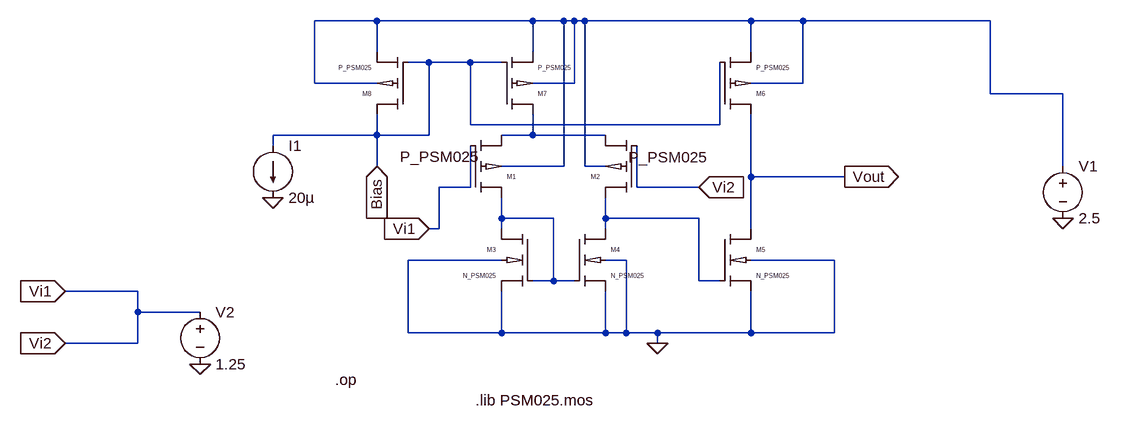
[diagram p0: schematic operating_point_opamp.asc]
operating_point_opamp.asc, the LTspice schematic file:
Version 4
SHEET 1 1260 680
WIRE 144 0 48 0
WIRE 384 0 144 0
WIRE 432 0 384 0
WIRE 448 0 432 0
WIRE 464 0 448 0
WIRE 720 0 464 0
WIRE 800 0 720 0
WIRE 1088 0 800 0
WIRE 144 48 144 0
WIRE 384 48 384 0
WIRE 720 48 720 0
WIRE 224 64 192 64
WIRE 288 64 224 64
WIRE 336 64 288 64
WIRE 48 96 48 0
WIRE 144 96 48 96
WIRE 448 96 448 0
WIRE 448 96 384 96
WIRE 800 96 800 0
WIRE 800 96 720 96
WIRE 1088 112 1088 0
WIRE 1200 112 1088 112
WIRE 288 160 288 64
WIRE 672 160 672 64
WIRE 672 160 288 160
WIRE 144 176 144 144
WIRE 144 176 -16 176
WIRE 224 176 224 64
WIRE 224 176 144 176
WIRE 384 176 384 144
WIRE 384 176 336 176
WIRE 496 176 384 176
WIRE -16 192 -16 176
WIRE 144 224 144 176
WIRE 432 224 432 0
WIRE 432 224 336 224
WIRE 464 224 464 0
WIRE 496 224 464 224
WIRE 1200 224 1200 112
WIRE 720 240 720 144
WIRE 864 240 720 240
WIRE 288 256 288 192
WIRE 288 256 240 256
WIRE 544 256 544 192
WIRE 640 256 544 256
WIRE 336 304 336 272
WIRE 416 304 336 304
WIRE 496 304 496 272
WIRE 640 304 496 304
WIRE 240 320 240 256
WIRE 240 320 224 320
WIRE 336 320 336 304
WIRE 496 320 496 304
WIRE 720 320 720 240
WIRE 336 368 192 368
WIRE 528 368 496 368
WIRE 848 368 720 368
WIRE 416 400 416 304
WIRE 416 400 384 400
WIRE 448 400 416 400
WIRE 640 400 640 304
WIRE 672 400 640 400
WIRE -224 416 -336 416
WIRE -224 448 -224 416
WIRE -128 448 -224 448
WIRE 192 480 192 368
WIRE 336 480 336 416
WIRE 336 480 192 480
WIRE 496 480 496 416
WIRE 496 480 336 480
WIRE 528 480 528 368
WIRE 528 480 496 480
WIRE 576 480 528 480
WIRE 720 480 720 416
WIRE 720 480 576 480
WIRE 848 480 848 368
WIRE 848 480 720 480
WIRE -224 496 -224 448
WIRE -224 496 -336 496
WIRE 576 496 576 480
FLAG 576 496 0
FLAG 224 320 Vi1
IOPIN 224 320 In
FLAG 640 256 Vi2
IOPIN 640 256 In
FLAG 864 240 Vout
IOPIN 864 240 Out
FLAG 144 224 Bias
IOPIN 144 224 In
FLAG -16 272 0
FLAG 1200 304 0
FLAG -336 416 Vi1
IOPIN -336 416 In
FLAG -336 496 Vi2
IOPIN -336 496 In
FLAG -128 528 0
SYMBOL N_PSM025 384 320 M0
SYMATTR InstName M3
SYMATTR Value2 l=1u w=5.15u
SYMBOL N_PSM025 448 320 R0
SYMATTR InstName M4
SYMATTR Value2 l=1u w=5.15u
SYMBOL N_PSM025 672 320 R0
SYMATTR InstName M5
SYMATTR Value2 l=1u w=12.9u
SYMBOL current -16 192 R0
WINDOW 123 0 0 Left 2
WINDOW 39 0 0 Left 2
SYMATTR InstName I1
SYMATTR Value 20µ
SYMBOL voltage 1200 208 R0
WINDOW 123 0 0 Left 2
WINDOW 39 0 0 Left 2
SYMATTR InstName V1
SYMATTR Value 2.5
SYMBOL voltage -128 432 R0
WINDOW 123 0 0 Left 2
WINDOW 39 0 0 Left 2
SYMATTR InstName V2
SYMATTR Value 1.25
SYMBOL P_PSM025 192 144 R180
SYMATTR InstName M8
SYMATTR Value2 l=1u w=17.15u
SYMBOL P_PSM025 336 144 M180
SYMATTR InstName M7
SYMATTR Value2 l=1u w=34.3u
SYMBOL P_PSM025 288 272 M180
WINDOW 3 -108 63 Left 2
SYMATTR InstName M1
SYMATTR Value2 l=1u w=17.15u
SYMBOL P_PSM025 544 272 R180
WINDOW 3 -109 62 Left 2
SYMATTR InstName M2
SYMATTR Value2 l=1u w=17.15u
SYMBOL P_PSM025 672 144 M180
SYMATTR InstName M6
SYMATTR Value2 l=1u w=42.9u
TEXT 80 552 Left 2 !.op
TEXT 296 584 Left 2 !.lib PSM025.mos

The netlist it stands for:
* operating_point_opamp.asc
M3 N003 N003 0 0 N_PSM025 l=1u w=5.15u
M4 N004 N003 0 0 N_PSM025 l=1u w=5.15u
M5 Vout N004 0 0 N_PSM025 l=1u w=12.9u
I1 Bias 0 20µ
V1 N001 0 2.5
V2 Vi2 0 1.25
M8 Bias Bias N001 N001 P_PSM025 l=1u w=17.15u
M7 N002 Bias N001 N001 P_PSM025 l=1u w=34.3u
M1 N003 Vi2 N002 N001 P_PSM025 l=1u w=17.15u
M2 N004 Vi2 N002 N001 P_PSM025 l=1u w=17.15u
M6 Vout Bias N001 N001 P_PSM025 l=1u w=42.9u
.model NMOS NMOS
.model PMOS PMOS
.lib standard.mos
.op
.lib PSM025.mos
.lib PSM025.mos
.backanno
.end